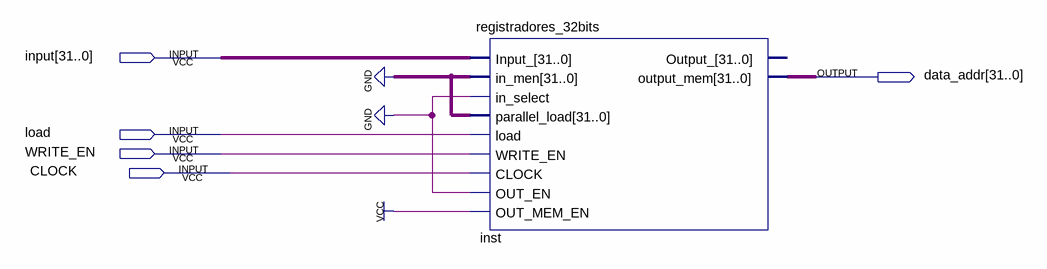
[diagram p0: schematic sheet]
// Quartus schematic MAR.bdf as structural Verilog: 1 symbols, 5 pins
module MAR (
  input  [31:0] \input ,
  input  load,
  input  WRITE_EN,
  input  CLOCK,
  output [31:0] data_addr
);

  registradores_32bits inst (
    .Input_(\input ), .in_men({32{1'b0}}), .in_select(1'b0), .parallel_load({32{1'b0}}), .load(load),
    .WRITE_EN(WRITE_EN), .CLOCK(CLOCK), .OUT_EN(1'b0), .OUT_MEM_EN(1'b1), .output_mem(data_addr));  // open: Output_
endmodule
